# Altium schematic sheet AS5048A.SchDoc
size A; SheetNumber: 4; SheetTotal: 4
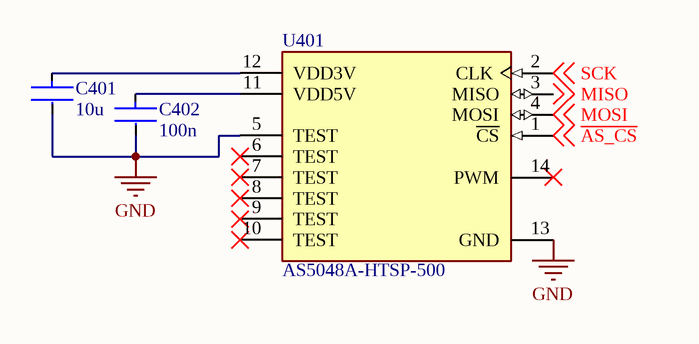
[diagram p0: AS5048A.SchDoc]

## Parts
C401  10u  [FP-GRT31C-0_2-IPC_C]
C402  100n  [FP-GCM155-0_05-MFG]
U401  AS5048A-HTSP-500  [TSOP65P640X120-14L]

## Nets
GND: C401.2 C402.2 U401.5(TEST) U401.13(GND)
~{AS_CS}: U401.1(~{CS}) ; off-sheet ~{AS_CS}
MISO: U401.3(MISO) ; off-sheet MISO
MOSI: U401.4(MOSI) ; off-sheet MOSI
SCK: U401.2(CLK) ; off-sheet SCK
NetC401_1: C401.1 U401.12(VDD3V)
NetC402_1: C402.1 U401.11(VDD5V)

Not connected (* = marked no-connect by the designer): U401 6(TEST)* 7(TEST)* 8(TEST)* 9(TEST)* 10(TEST)* 14(PWM)*

## Library data of the parts
C401 = GRT31CR61H106ME01L: CAP CER 10UF 50V X5R 1206; Tolerance: 20%; Length: 0.126inch; Mount: Surface Mount; Packaging: Tape and Reel; Capacitance: 10uF; Case/Package: 1206; Case Code (Imperial): 1206; Max Operating Temperature: 85°C; Voltage Rating: 50V; Ratings: AEC-Q200; Min Operating Temperature: -55°C; Thickness: 0.071inch; Width: 0.063inch; Case Code (Metric): 3216; Supplier 1: Digi-Key; Supplier Part Number 1: 490-12457-1-ND
C402 = GCM155R71H104KE02J: Ceramic Capacitor for Automotive 100nF ±10% 50VDC X7R 0402 Paper T/R; Voltage Rating (DC): 50V; Case Code (Metric): 1005; Dielectric: X7R; Capacitance: 100nF; Packaging: Tape and Reel; Min Operating Temperature: -55°C; Length: 0.039inch; Thickness: 0.022inch; Height: 0.5mm; Mount: Surface Mount; Termination: SMD/SMT; Voltage Rating: 50V; Package Quantity: 50000; Width: 0.02inch; Case/Package: 0402; Case Code (Imperial): 0402; Ratings: AEC-Q200; Max Operating Temperature: 125°C; Tolerance: 10%; Weight: 0.000212oz; Supplier 1: Digi-Key; Supplier Part Number 1: 490-14514-1-ND
U401 = AS5048A-HTSP-500: SENSOR ANGLE 360DEG SMD; Operating Supply Current: 15mA; Min Supply Voltage: 4.5V; Max Supply Voltage: 5.5V; Resolution: 14b; Sensing Method: Hall Effect; Max Operating Temperature: 150°C; Case/Package: TSSOP; Termination: SMD/SMT; Lead Free: Lead Free; Mount: Surface Mount; Package Quantity: 500; Min Operating Temperature: -40°C; Packaging: Tape and Reel; Supplier 1: Mouser; Supplier Part Number 1: 985-AS5048A-HTSP-500